# Altium schematic sheet SCHE_Doan2.SchDoc
size B; SheetNumber: 1; SheetTotal: 1
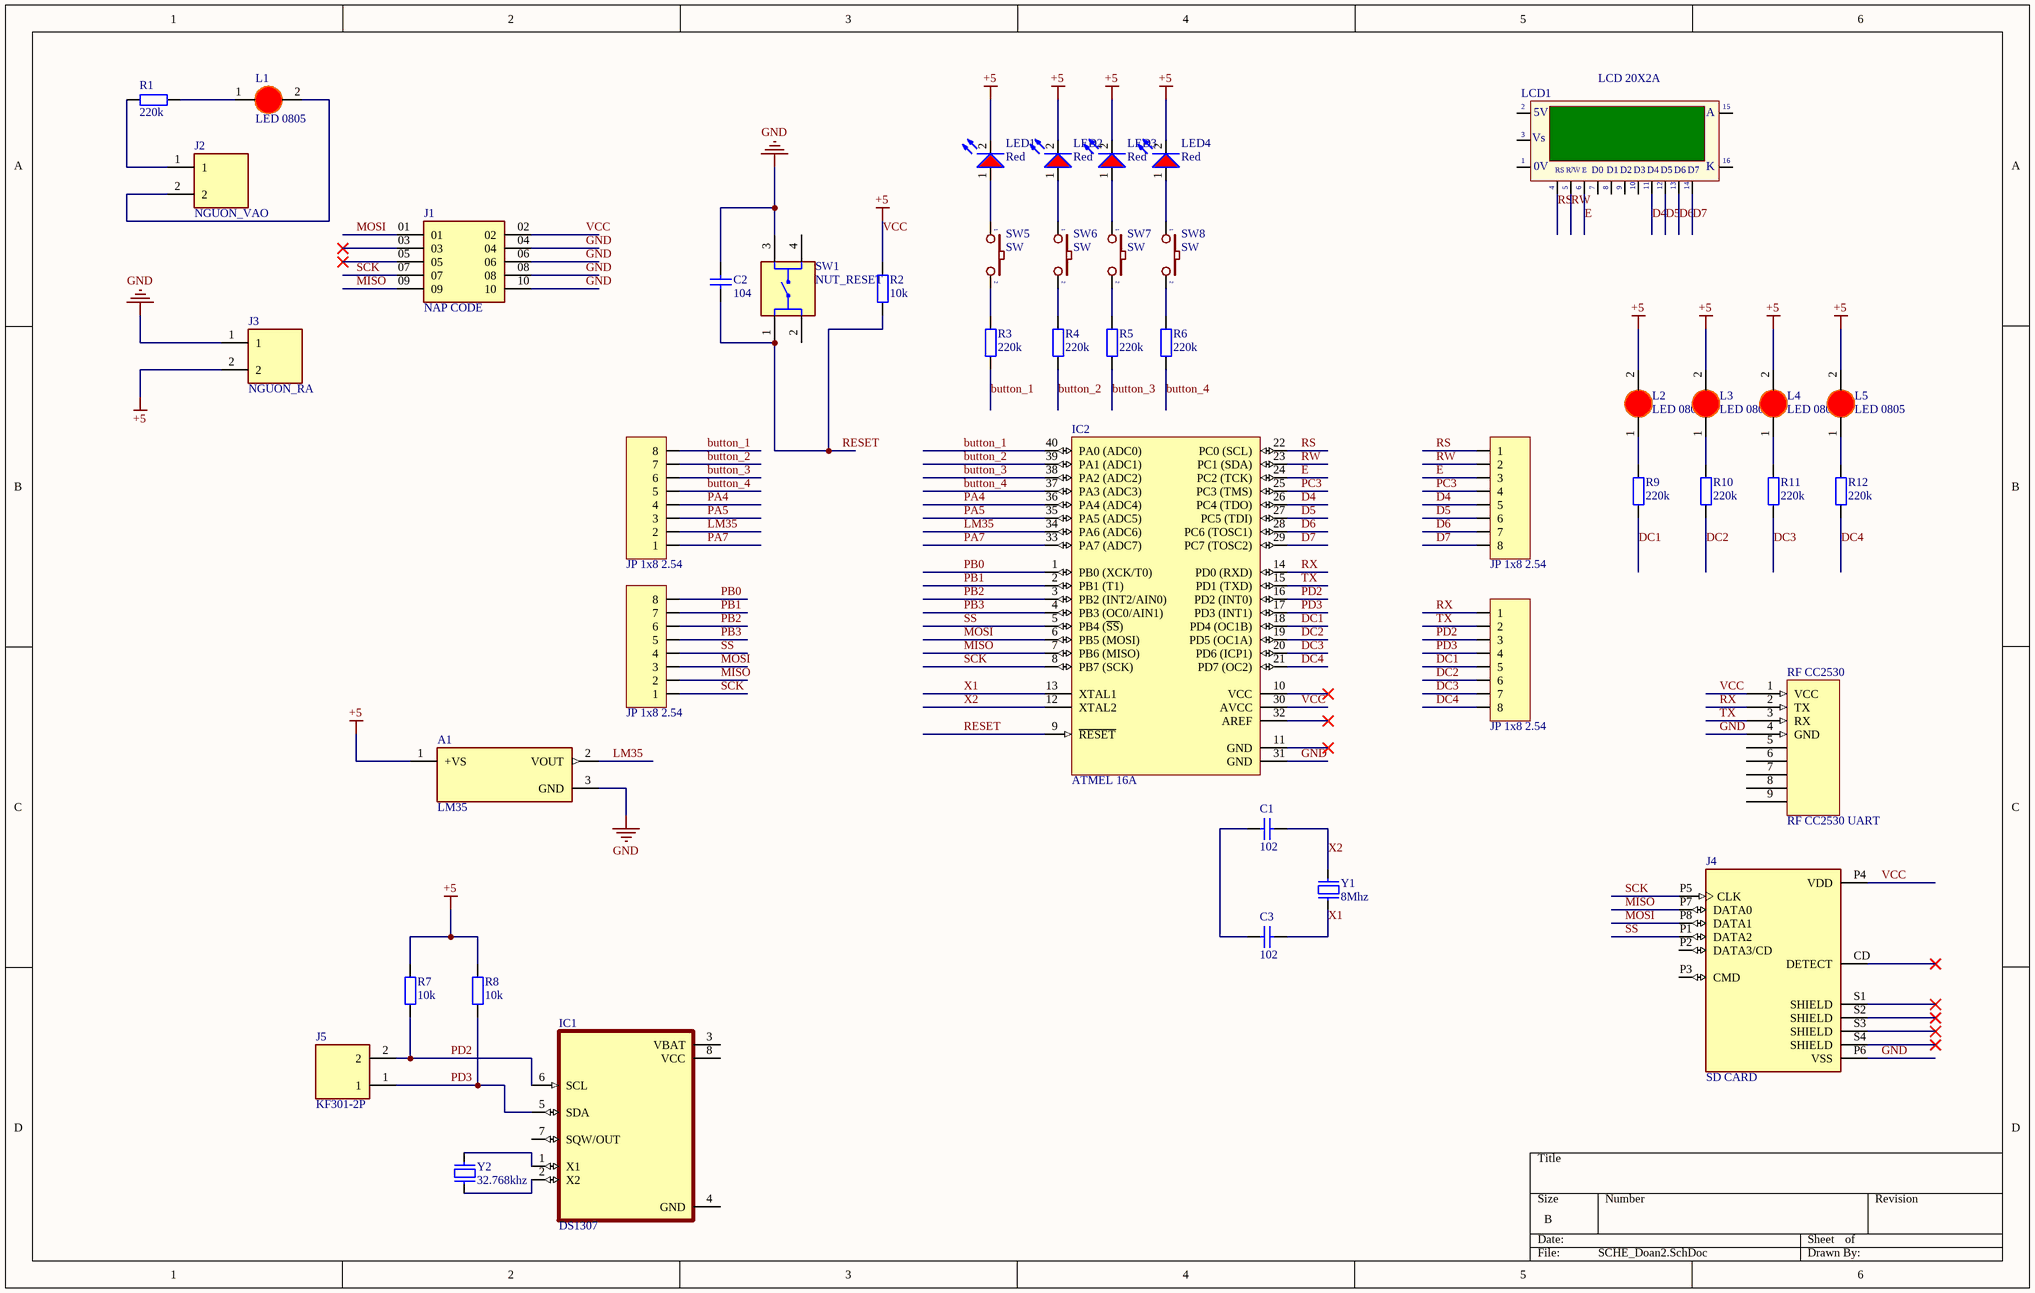
[diagram p0: SCHE_Doan2.SchDoc]

## Parts
A1  LM35  [TO92127P521H735-3]
C1  102  [tu gom]
C2  104  [tu gom]
C3  102  [tu gom]
IC1  DS1307  [DIP794W47P254L991H457Q8]
IC2  ATMEL 16A  [DIP40/W0.6]
J1  NAP CODE  [SAMTEC_ZSS-105-09-L-D-1290]
J2  NGUON_VAO  [HANDSON_KF301-2P]
J3  NGUON_RA  [HANDSON_KF301-2P]
J4  SD CARD  [GCT_MEM2051-00-195-00-A_REVD1]
J5  KF301-2P  [HANDSON_KF301-2P]
JP1  JP 1x8 2.54  [JP 1x8 CT]
JP2  JP 1x8 2.54  [JP 1x8 CT]
JP3  JP 1x8 2.54  [JP 1x8 CT]
JP4  JP 1x8 2.54  [JP 1x8 CT]
L1  LED 0805  [LED-0805-Red]
L2  LED 0805  [LED-0805-Red]
L3  LED 0805  [LED-0805-Red]
L4  LED 0805  [LED-0805-Red]
L5  LED 0805  [LED-0805-Red]
LCD1  LCD 20X2A  [LCD16X2]
LED1  value Red  [LED-RED-0805]  (hidden comment: LED-Red)
LED2  value Red  [LED-RED-0805]  (hidden comment: LED-Red)
LED3  value Red  [LED-RED-0805]  (hidden comment: LED-Red)
LED4  value Red  [LED-RED-0805]  (hidden comment: LED-Red)
R1  220k  [tro smd 0805]
R2  10k  [tro smd 0805]
R3  220k  [tro smd 0805]
R4  220k  [tro smd 0805]
R5  220k  [tro smd 0805]
R6  220k  [tro smd 0805]
R7  10k  [tro smd 0805]
R8  10k  [tro smd 0805]
R9  220k  [tro smd 0805]
R10  220k  [tro smd 0805]
R11  220k  [tro smd 0805]
R12  220k  [tro smd 0805]
RF_CC2530  RF CC2530 UART  [CC2530]
SW1  NUT_RESET  [SW_1825910-6-4]
SW5  SW  [SW1-SMD]
SW6  SW  [SW1-SMD]
SW7  SW  [SW1-SMD]
SW8  SW  [SW1-SMD]
Y1  8Mhz  [Thach Anh 2 Chan 32,768 KHz]
Y2  32.768khz  [Thach Anh 2 Chan 32,768 KHz]

## Nets
GND: A1.3(GND) C2.1 IC2.31(GND) J1.04 J1.06 J1.08 J1.10 J3.1 J4.P6(VSS) RF_CC2530.4(GND) SW1.3
VCC: A1.1(+VS) IC2.30(AVCC) J1.02 J3.2 J4.P4(VDD) L2.2(K) L3.2(K) L4.2(K) L5.2(K) LED1.2(K) LED2.2(K) LED3.2(K) LED4.2(K) R2.2 R7.2 R8.2 RF_CC2530.1(VCC)  [also labelled +5]
button_1: IC2.40(PA0_(ADC0)) JP2.8 R3.1
button_2: IC2.39(PA1_(ADC1)) JP2.7 R4.1
button_3: IC2.38(PA2_(ADC2)) JP2.6 R5.1
button_4: IC2.37(PA3_(ADC3)) JP2.5 R6.1
D4: IC2.26(PC4_(TDO)) JP1.5 LCD1.11(D4)
D5: IC2.27(PC5_(TDI)) JP1.6 LCD1.12(D5)
D6: IC2.28(PC6_(TOSC1)) JP1.7 LCD1.13(D6)
D7: IC2.29(PC7_(TOSC2)) JP1.8 LCD1.14(D7)
DC1: IC2.18(PD4_(OC1B)) JP4.5 R9.1
DC2: IC2.19(PD5_(OC1A)) JP4.6 R10.1
DC3: IC2.20(PD6_(ICP1)) JP4.7 R11.1
DC4: IC2.21(PD7_(OC2)) JP4.8 R12.1
E: IC2.24(PC2_(TCK)) JP1.3 LCD1.6(~{EN})
LM35: A1.2(VOUT) IC2.34(PA6_(ADC6)) JP2.2
MISO: IC2.7(PB6_(MISO)) J1.09 J4.P7(DATA0) JP3.2
MOSI: IC2.6(PB5_(MOSI)) J1.01 J4.P8(DATA1) JP3.3
PA4: IC2.36(PA4_(ADC4)) JP2.4
PA5: IC2.35(PA5_(ADC5)) JP2.3
PA7: IC2.33(PA7_(ADC7)) JP2.1
PB0: IC2.1(PB0_(XCK/T0)) JP3.8
PB1: IC2.2(PB1_(T1)) JP3.7
PB2: IC2.3(PB2_(INT2/AIN0)) JP3.6
PB3: IC2.4(PB3_(OC0/AIN1)) JP3.5
PC3: IC2.25(PC3_(TMS)) JP1.4
PD2: IC1.6(SCL) IC2.16(PD2_(INT0)) J5.2 JP4.3 R7.1
PD3: IC1.5(SDA) IC2.17(PD3_(INT1)) J5.1 JP4.4 R8.1
RESET: C2.2 IC2.9(~{RESET}) R2.1 SW1.1
RS: IC2.22(PC0_(SCL)) JP1.1 LCD1.4(RS)
RW: IC2.23(PC1_(SDA)) JP1.2 LCD1.5(R/~{W})
RX: IC2.14(PD0_(RXD)) JP4.1 RF_CC2530.2(TX)
SCK: IC2.8(PB7_(SCK)) J1.07 J4.P5(CLK) JP3.1
SS: IC2.5(PB4_(~{SS})) J4.P1(DATA2) JP3.4
TX: IC2.15(PD1_(TXD)) JP4.2 RF_CC2530.3(RX)
X1: C3.1 IC2.13(XTAL1) Y1.1
X2: C1.1 IC2.12(XTAL2) Y1.2
NetC1_2: C1.2 C3.2
NetIC1_1: IC1.1(X1) Y2.2
NetIC1_2: IC1.2(X2) Y2.1
NetJ2_1: J2.1 R1.1
NetJ2_2: J2.2 L1.2(K)
NetL1_1: L1.1(A) R1.2
NetL2_1: L2.1(A) R9.2
NetL3_1: L3.1(A) R10.2
NetL4_1: L4.1(A) R11.2
NetL5_1: L5.1(A) R12.2
NetLED1_1: LED1.1(A) SW5.1
NetLED2_1: LED2.1(A) SW6.1
NetLED3_1: LED3.1(A) SW7.1
NetLED4_1: LED4.1(A) SW8.1
NetR3_2: R3.2 SW5.2
NetR4_2: R4.2 SW6.2
NetR5_2: R5.2 SW7.2
NetR6_2: R6.2 SW8.2

Not connected (* = marked no-connect by the designer): IC1 3(VBAT) 4(GND) 7(SQW/OUT) 8(VCC); IC2 10(VCC)* 11(GND)* 32(AREF)*; J1 03* 05*; J4 CD(DETECT)* P2(DATA3/CD) P3(CMD) S1(SHIELD)* S2(SHIELD)* S3(SHIELD)* S4(SHIELD)*; LCD1 1(GND) 2(VDD) 3(VEE) 7(D0) 8(D1) 9(D2) 10(D3) 15(A) 16(K); RF_CC2530 5 6 7 8 9; SW1 2 4

## Notes on the sheet
- (in symbol LCD16x2A) 5V; Vs; |; 0V; R/W; E

## Library data of the parts
A1 = LM35DZ/NOPB: Package: None; Price: None; Availability: Unavailable; MP: LM35DZ/NOPB; Value: *
C1 C3 = Tu gom 102 50V: Cắm; Don_Vi: Con; So_Chan: 2; Ten_Linh_Kien: Tụ gốm 102 1nF 50V; Ma_Hang: MH004763; Chung_Loai: Cắm; Kieu_Chan: *
C2 = Tu gom 104 50V: Cắm; So_Chan: 2; Ten_Linh_Kien: Tụ gốm 104 100nF 50V; Don_Vi: Con; Ma_Hang: MH004761; Chung_Loai: Cắm; Kieu_Chan: *
IC1 = DS1307: Real Time Clock _RTC_ IC Clock/Calendar 56B IÂ²C, 2-Wire Serial 8-DIP _0.300, 7.62mm_; MF: Maxim Integrated; Value: *; Package: DIP-8 Maxim Integrated; Availability: Unavailable; SnapEDA_Link: https://www.snapeda.com/parts/DS1307/Maxim%20Integrated/view-part/9751/?ref=snap; MP: DS1307; Price: None
IC2 = ATmega16A-PU: 8-Bit AVR Microcontroller with 16K Bytes of In-System Programmable Flash Memory; Value: Atmega 16L
J1 = ZSS-105-09-L-D-1290: Package: None; MP: ZSS-105-09-L-D-1290; Price: None; Availability: Unavailable; Value: *
J2 J3 J5 = KF301-2P: 2 Pin Terminal Block 5mm Pitch; MF: Handson Technology; Value: *; Package: None; Check_prices: https://www.snapeda.com/parts/KF301-2P/Handson+Technology/view-part/?ref=eda; Price: None; MP: KF301-2P; Availability: Not in stock; SnapEDA_Link: https://www.snapeda.com/parts/KF301-2P/Handson+Technology/view-part/?ref=snap
J4 = MEM2051-00-195-00-A_REVD1: Package: None; Availability: Unavailable; Value: *; MP: MEM2051-00-195-00-A_REVD1; Price: None
JP1-JP4 = JP 1x8 2.54 Cai Thang: Cắm; Ten_Linh_Kien: Jump Đơn Cái 2.54MM 1x20P Thẳng; Don_Vi: Con; Ma_Hang: MH004006; Ghi_Chu: *; Kieu_Chan: *; Chung_Loai: Cắm
L1-L5 = LED 0805 Do: Dán; Don_Vi: Con; Ma_Hang: MH000897; Ten_Linh_Kien: LED 0805 Màu Đỏ (Red); Ghi_Chu: *; Kieu_Chan: *; Chung_Loai: Dán
LCD1 = LCD16x2A: LCD dipslay 16 char, 2 line; Value: LCD16x2A
LED1-LED4 = Led-Red: LED Red 2mA 1.8V 0805; ComponentLink1Description: Datasheet; ComponentLink1URL: D:\Dropbox\Datasheets\Opto and Illumination\LEDs\SMD LED.pdf; Unit Price: 0.0476
R1 R3-R6 R9-R12 = Tro 0805 1% 220k: Dán; Don_Vi: Con; So_Chan: 2; Ten_Linh_Kien: Trở 0805 1% 220k; Ma_Hang: MH005484; Chung_Loai: Dán; Kieu_Chan: *
R2 R7 R8 = Tro 0805 1% 10k: Dán; Don_Vi: Con; So_Chan: 2; Ten_Linh_Kien: Trở 0805 1% 10k; Ma_Hang: MH005473; Chung_Loai: Dán; Kieu_Chan: *
RF_CC2530 = RF CC2530 UART 2.4G: IC chính: CC2530, 15.5 x 31.5mm; TECHMT.VN: TECHMT.VN
SW1 = 1825910-6: Switch Tactile OFF (ON) SPST Round Button PC Pins 0.05A 24VDC 100000Cycles 1.57N Thru-Hole Loose; Package: None; MP: 1825910-6; Value: *; Price: None; Availability: Unavailable
SW5-SW8 = SW2: Switch button 2 pin; Value: SW chip 2 pin
Y1 Y2 = Thach Anh 2 chan 32,768 Khz: Crystal For all Crystal 2pin.; Value: 4Mhz